# EasyEDA schematic SCH_Sega Pad - Amiga Joystick_2022-07-28.json
TITLE: Sega Pad -> Amiga/C64 Joystick + Autofire; REV: 3.0; Date: 2021-11-08; Sheet: 1/1; Drawn By: Maciej Miklas; Company: Maciej Miklas
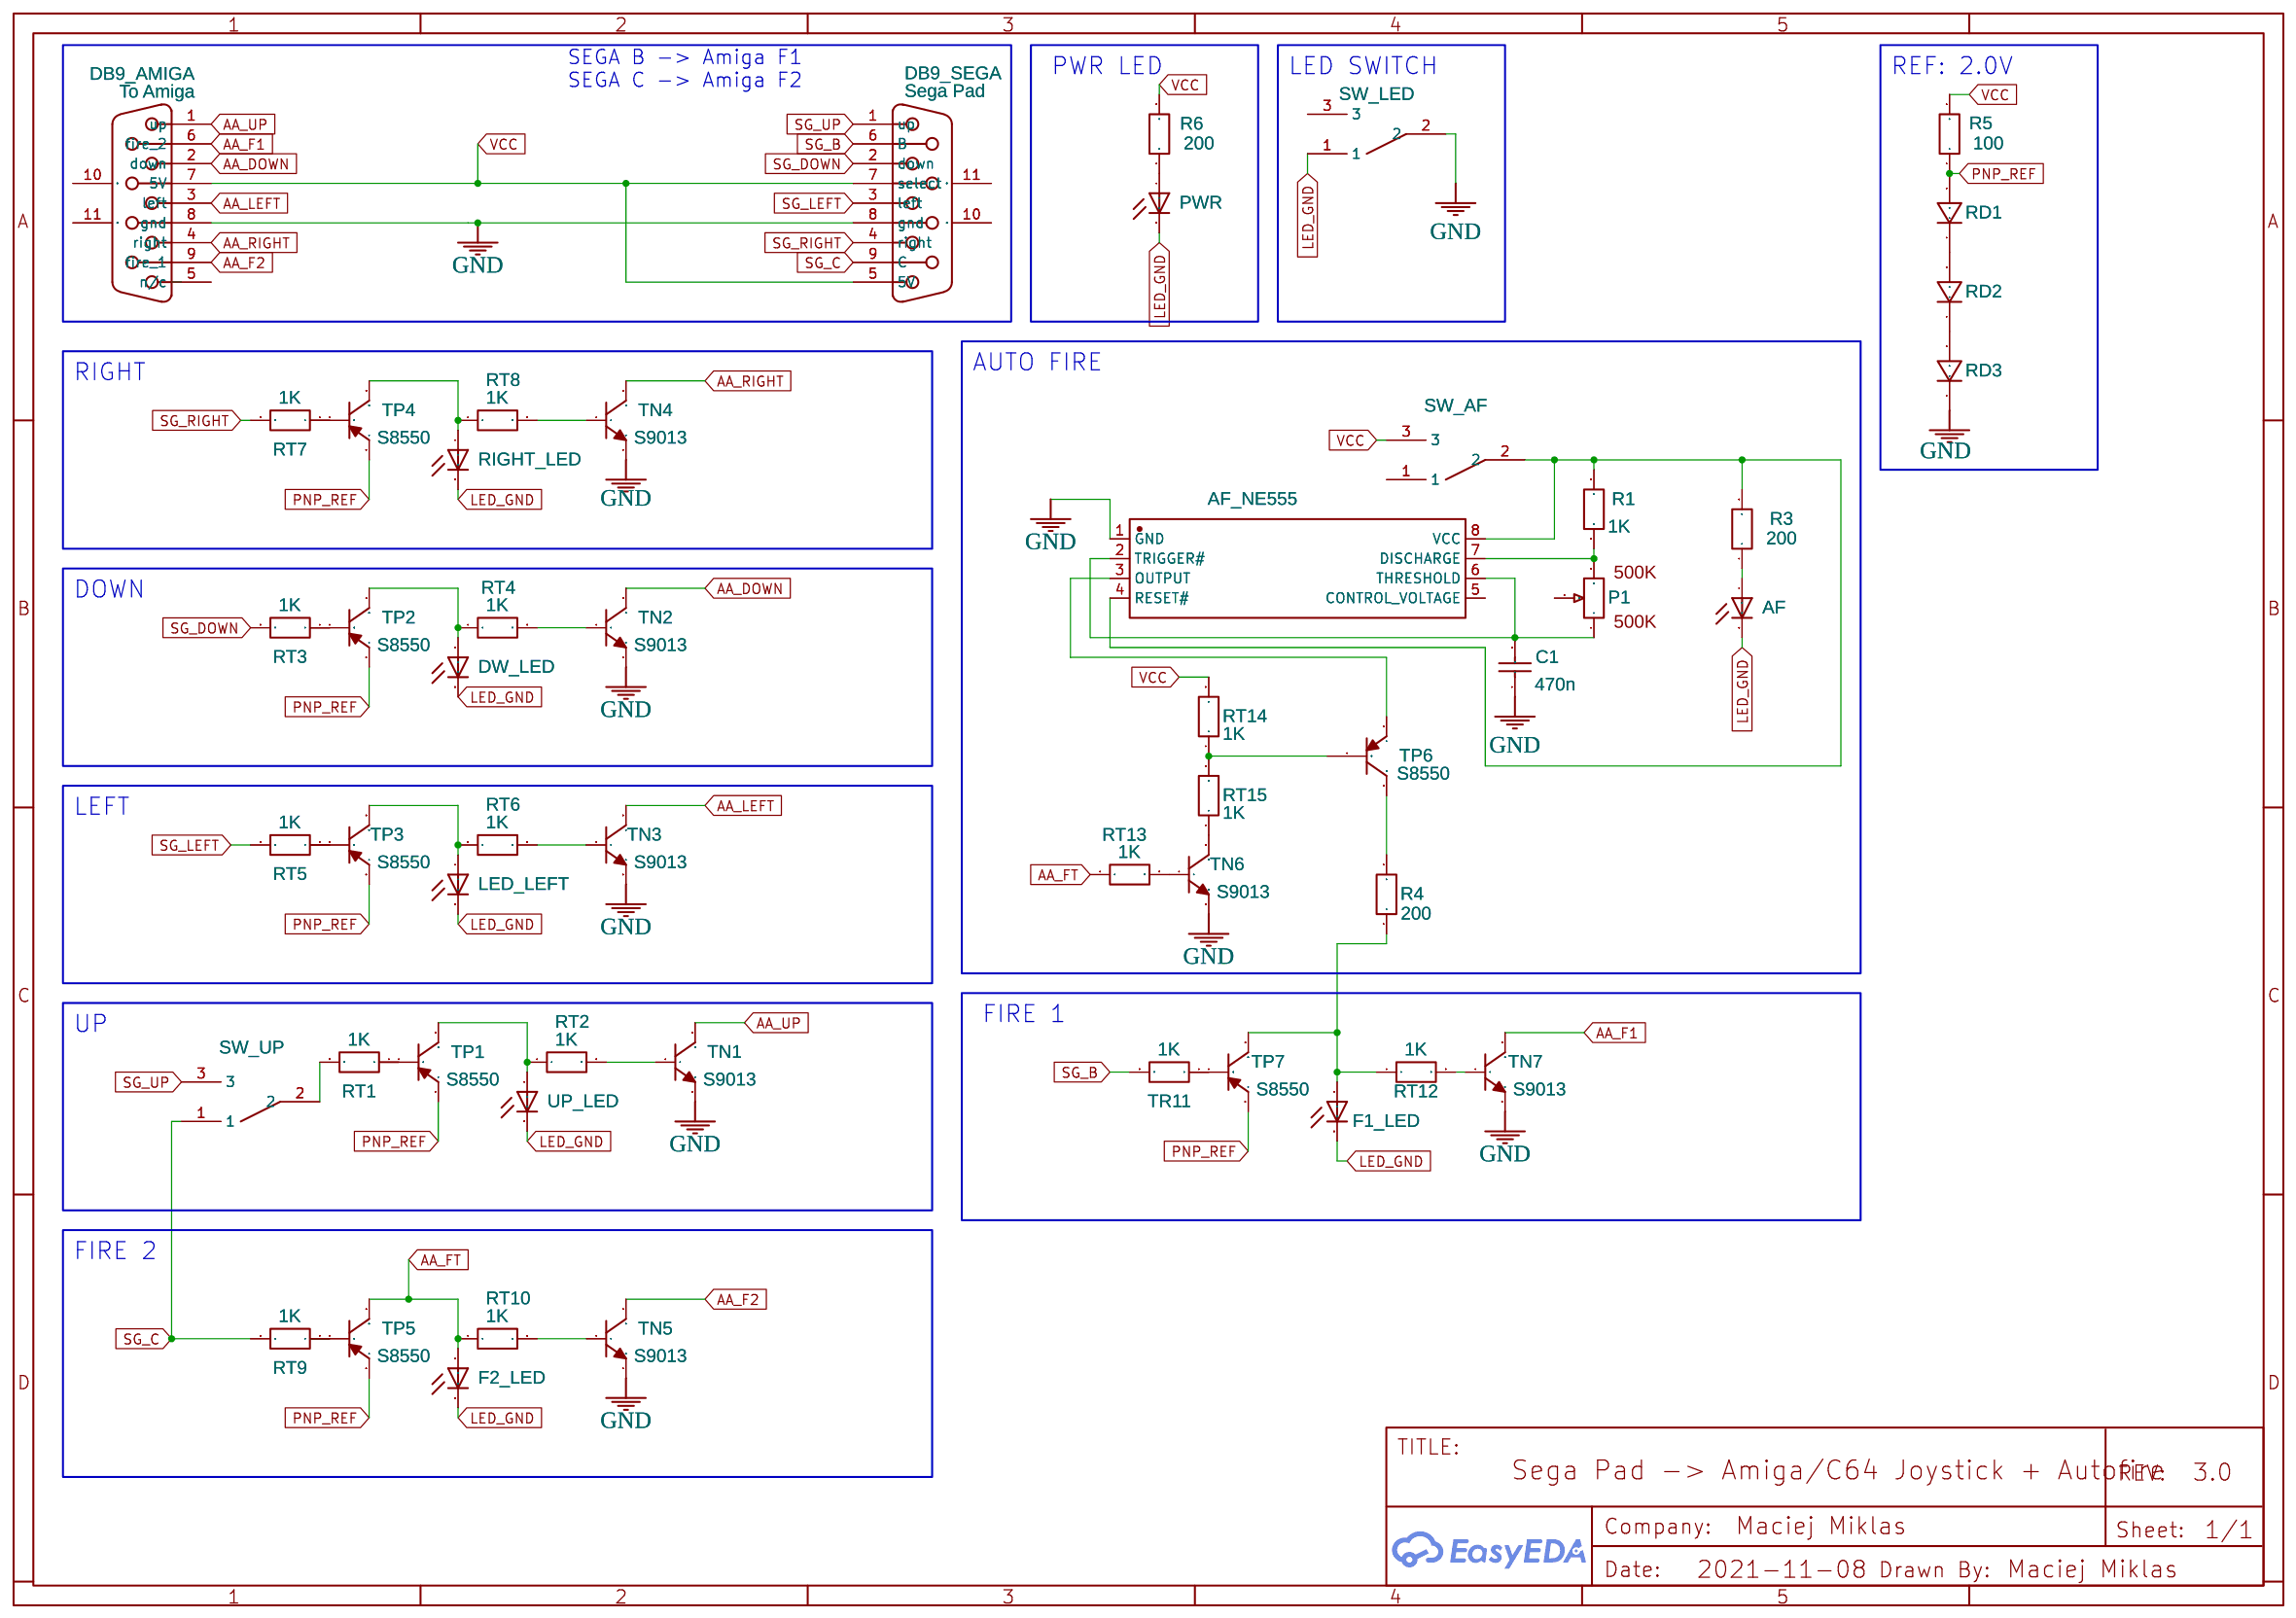
[diagram p0: schematic sheet]

## Parts
AF  LED  [CHIPLED_0603]
AF_555  AF_NE555  [SOP-8_L4.9-W3.9-P1.27-LS6.0-BL]
C1  470n  [C0805]
DB9_AMIGA  To Amiga  [DSUB-TH_DMR-9S]
DB9_SEGA  Sega Pad  [DSUB-TH_DMR-9P]
DW_LED  LED  [CHIPLED_0603]
F1_LED  LED  [CHIPLED_0603]
F2_LED  LED  [CHIPLED_0603]
LED_LEFT  LED  [CHIPLED_0603]
P1  potentiometer  [POTENTIOMETER]
PWR  LED  [CHIPLED_0603]
R1  1K  [R0805]
R3  200  [R0805]
R4  200  [R0805]
R5  100  [R0805]
R6  200  [R0805]
RD1  1N4148W-13-F  [SOD-123_L2.7-W1.6-LS3.7-RD]
RD2  1N4148W-13-F  [SOD-123_L2.7-W1.6-LS3.7-RD]
RD3  1N4148W-13-F  [SOD-123_L2.7-W1.6-LS3.7-RD]
RIGHT_LED  LED  [CHIPLED_0603]
RT1  1K  [R0805]
RT2  1K  [R0805]
RT3  1K  [R0805]
RT4  1K  [R0805]
RT5  1K  [R0805]
RT6  1K  [R0805]
RT7  1K  [R0805]
RT8  1K  [R0805]
RT9  1K  [R0805]
RT10  1K  [R0805]
RT12  1K  [R0805]
RT13  1K  [R0805]
RT14  1K  [R0805]
RT15  1K  [R0805]
SW_AF  1P2T  [1P2T]
SW_LED  1P2T  [1P2T]
SW_UP  1P2T  [1P2T]
TN1  S9013  [SOT-23-3_L2.9-W1.6-P1.90-LS2.8-BR]
TN2  S9013  [SOT-23-3_L2.9-W1.6-P1.90-LS2.8-BR]
TN3  S9013  [SOT-23-3_L2.9-W1.6-P1.90-LS2.8-BR]
TN4  S9013  [SOT-23-3_L2.9-W1.6-P1.90-LS2.8-BR]
TN5  S9013  [SOT-23-3_L2.9-W1.6-P1.90-LS2.8-BR]
TN6  S9013  [SOT-23-3_L2.9-W1.6-P1.90-LS2.8-BR]
TN7  S9013  [SOT-23-3_L2.9-W1.6-P1.90-LS2.8-BR]
TP1  S8550  [SOT-23-3_L2.9-W1.3-P1.90-LS2.4-BR]
TP2  S8550  [SOT-23-3_L2.9-W1.3-P1.90-LS2.4-BR]
TP3  S8550  [SOT-23-3_L2.9-W1.3-P1.90-LS2.4-BR]
TP4  S8550  [SOT-23-3_L2.9-W1.3-P1.90-LS2.4-BR]
TP5  S8550  [SOT-23-3_L2.9-W1.3-P1.90-LS2.4-BR]
TP6  S8550  [SOT-23-3_L2.9-W1.3-P1.90-LS2.4-BR]
TP7  S8550  [SOT-23-3_L2.9-W1.3-P1.90-LS2.4-BR]
TR11  1K  [R0805]
UP_LED  LED  [CHIPLED_0603]

## Library data of the parts
AF DW_LED F1_LED F2_LED LED_LEFT PWR RIGHT_LED UP_LED = LED: Contributor: Adafruit; Package Display: No
AF_555 = NE555D_C596355: Supplier: LCSC; Supplier Part: C596355; Manufacturer: HTC Korea TAEJIN Tech; Manufacturer Part: NE555D; Contributor: LCSC; Package Display: No
C1 = CC0805KKX7R9BB105: Supplier: LCSC; Manufacturer: YAGEO; Supplier Part: C91185; JLCPCB Part Class: Extended Part
DB9_AMIGA = DB9_Female: Supplier Part: C141882; Supplier: LCSC; Manufacturer: Ckmtw(灿科盟); Contributor: LCEDA_Lib
DB9_SEGA = DB9_Male: Supplier Part: C185657; Supplier: LCSC; Manufacturer: Amphenol; Contributor: LCEDA_Lib
P1 = potentiometer: Contributor: sausnet 1975
R1 R3-R6 RT1-RT10 RT12-RT15 TR11 = WR08X102 JTL: Supplier: LCSC; Supplier Part: C384174; Manufacturer: Walsin Tech Corp; Contributor: LCSC; Package Display: No
RD1-RD3 = 1N4148W-13-F: Supplier Part: C112342; Supplier: LCSC; Manufacturer: DIODES; Contributor: LCSC; JLCPCB Part Class: Extended Part
SW_AF SW_LED SW_UP = 1P2T: Contributor: dip56245
TN1-TN7 = S9013 120-200: Supplier: LCSC; Manufacturer: CJ; Supplier Part: C107404; JLCPCB Part Class: Extended Part; Package Display: No
TP1 TP4-TP6 = S8550_C2828467: Supplier: LCSC; Supplier Part: C2828467; Manufacturer: CBI(创基); Contributor: LCSC
TP2 TP3 TP7 = S8550_C2828467: Supplier: LCSC; Supplier Part: C2828467; Manufacturer: CBI(创基); Contributor: LCSC; Package Display: No

## Nets
GND: AF_555.1(GND) C1.1 DB9_AMIGA.8(gnd) DB9_SEGA.8(gnd) RD3.1 SW_LED.2 TN1.2 TN2.2 TN3.2 TN4.2 TN5.2 TN6.2 TN7.2
VCC: DB9_AMIGA.7(5V) DB9_SEGA.5(5V) DB9_SEGA.7(select) R5.2 R6.2 RT14.2 SW_AF.3
AA_DOWN: DB9_AMIGA.2(down) TN2.3
AA_F1: DB9_AMIGA.6(fire 2) TN7.3
AA_F2: DB9_AMIGA.9(fire 1) TN5.3
AA_FT: F2_LED.A RT10.1 RT13.1 TP5.3(C)
AA_LEFT: DB9_AMIGA.3(left) TN3.3
AA_RIGHT: DB9_AMIGA.4(right) TN4.3
AA_UP: DB9_AMIGA.1(up) TN1.3
LED_GND: AF.C DW_LED.C F1_LED.C F2_LED.C LED_LEFT.C PWR.C RIGHT_LED.C SW_LED.1 UP_LED.C
PNP_REF: R5.1 RD1.2 TP1.2(E) TP2.2(E) TP3.2(E) TP4.2(E) TP5.2(E) TP7.2(E)
SG_B: DB9_SEGA.6(B) TR11.2
SG_C: DB9_SEGA.9(C) RT9.2 SW_UP.1
SG_DOWN: DB9_SEGA.2(down) RT3.2
SG_LEFT: DB9_SEGA.3(left) RT5.2
SG_RIGHT: DB9_SEGA.4(right) RT7.2
SG_UP: DB9_SEGA.1(up) SW_UP.3
Net-(AF-A): AF.A R3.1
Net-(AF_555-2): AF_555.2(TRIGGER#) AF_555.6(THRESHOLD) C1.2 P1.1
Net-(AF_555-3): AF_555.3(OUTPUT) TP6.2(E)
Net-(AF_555-4): AF_555.4(RESET#) AF_555.8(VCC) R1.2 R3.2 SW_AF.2
Net-(AF_555-7): AF_555.7(DISCHARGE) P1.3 R1.1
Net-(DW_LED-A): DW_LED.A RT4.1 TP2.3(C)
Net-(F1_LED-A): F1_LED.A R4.1 RT12.1 TP7.3(C)
Net-(LED_LEFT-A): LED_LEFT.A RT6.1 TP3.3(C)
Net-(PWR-A): PWR.A R6.1
Net-(R4-2): R4.2 TP6.3(C)
Net-(RD1-1): RD1.1 RD2.2
Net-(RD2-1): RD2.1 RD3.2
Net-(RIGHT_LED-A): RIGHT_LED.A RT8.1 TP4.3(C)
Net-(RT1-1): RT1.1 TP1.1(B)
Net-(RT1-2): RT1.2 SW_UP.2
Net-(RT2-1): RT2.1 TP1.3(C) UP_LED.A
Net-(RT2-2): RT2.2 TN1.1
Net-(RT3-1): RT3.1 TP2.1(B)
Net-(RT4-2): RT4.2 TN2.1
Net-(RT5-1): RT5.1 TP3.1(B)
Net-(RT6-2): RT6.2 TN3.1
Net-(RT7-1): RT7.1 TP4.1(B)
Net-(RT8-2): RT8.2 TN4.1
Net-(RT9-1): RT9.1 TP5.1(B)
Net-(RT10-2): RT10.2 TN5.1
Net-(RT12-2): RT12.2 TN7.1
Net-(RT13-2): RT13.2 TN6.1
Net-(RT14-1): RT14.1 RT15.2 TP6.1(B)
Net-(RT15-1): RT15.1 TN6.3
Net-(TP7-1): TP7.1(B) TR11.1

Not connected (* = marked no-connect by the designer): AF_555 5(CONTROL VOLTAGE); DB9_AMIGA 5(n/c) 10(MH1) 11(MH2); DB9_SEGA 10(MH1) 11(MH2); P1 2; SW_AF 1; SW_LED 3

## Notes on the sheet
- SEGA B -> Amiga F1
  SEGA C -> Amiga F2
- PWR LED
- LED SWITCH
- REF: 2.0V
- RIGHT
- AUTO FIRE
- DOWN
- LEFT
- FIRE 1
- UP
- FIRE 2
